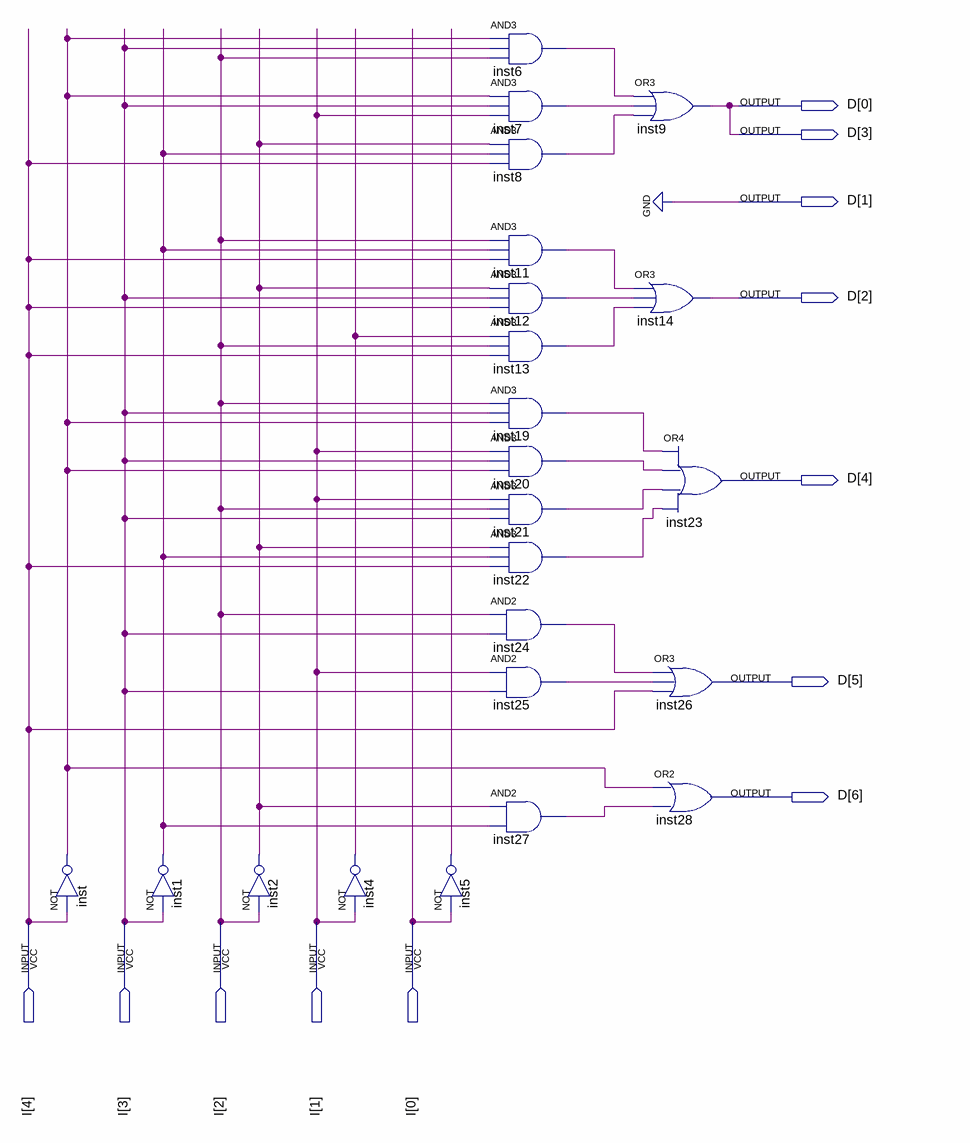
[diagram p0: schematic sheet]
// Quartus schematic Tens7Segments5BitsDecoder.bdf as structural Verilog: 23 symbols, 12 pins
module Tens7Segments5BitsDecoder (
  input  [4:0] I,
  output [6:0] D
);

  wire inst1_out, inst2_out, inst4_out, inst5_out, inst6_out, inst7_out, inst8_out, inst11_out, inst12_out,
       inst13_out, inst19_out, inst20_out, inst21_out, inst22_out, inst24_out, inst25_out, inst27_out,
       inst_out;

  not inst (inst_out, I[4]);
  not inst1 (inst1_out, I[3]);
  not inst2 (inst2_out, I[2]);
  not inst4 (inst4_out, I[1]);
  not inst5 (inst5_out, I[0]);
  and inst6 (inst6_out, inst_out, I[3], I[2]);
  and inst7 (inst7_out, inst_out, I[3], I[1]);
  and inst8 (inst8_out, inst2_out, inst1_out, I[4]);
  and inst11 (inst11_out, I[2], inst1_out, I[4]);
  and inst12 (inst12_out, inst2_out, I[3], I[4]);
  and inst13 (inst13_out, inst4_out, I[2], I[4]);
  and inst19 (inst19_out, I[2], I[3], inst_out);
  and inst20 (inst20_out, I[1], I[3], inst_out);
  and inst21 (inst21_out, I[1], I[2], I[3]);
  and inst22 (inst22_out, inst2_out, inst1_out, I[4]);
  and inst24 (inst24_out, I[2], I[3]);
  and inst25 (inst25_out, I[1], I[3]);
  and inst27 (inst27_out, inst2_out, inst1_out);
  or inst9 (D[3], inst6_out, inst7_out, inst8_out);
  or inst14 (D[2], inst11_out, inst12_out, inst13_out);
  or inst23 (D[4], inst19_out, inst20_out, inst21_out, inst22_out);
  or inst26 (D[5], inst24_out, inst25_out, I[4]);
  or inst28 (D[6], inst_out, inst27_out);

  assign D[1:0] = {1'b0, D[3]};
endmodule
